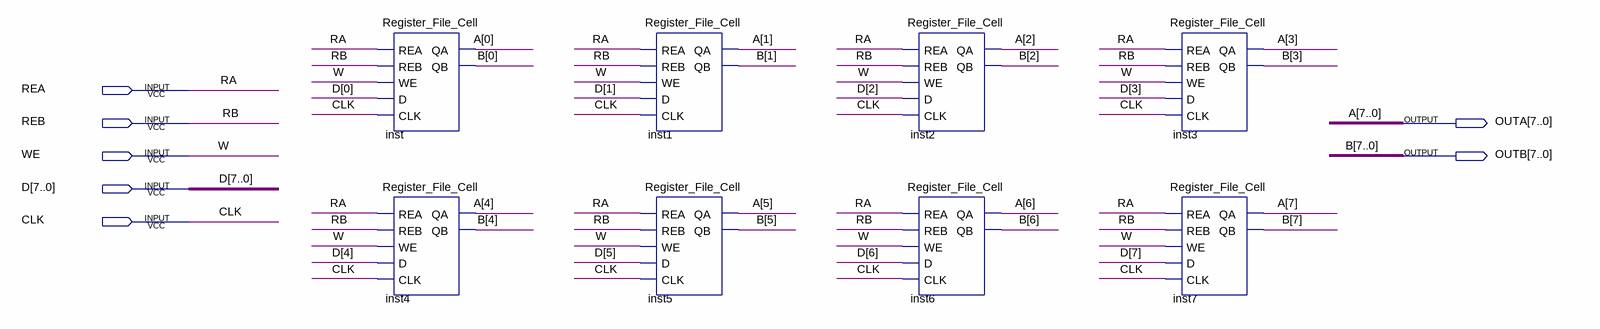
[diagram p0: schematic sheet]
// Quartus schematic Register_File_1X8.bdf as structural Verilog: 8 symbols, 7 pins
module Register_File_1X8 (
  input  REA,
  input  REB,
  input  WE,
  input  [7:0] D,
  input  CLK,
  output [7:0] OUTA,
  output [7:0] OUTB
);

  Register_File_Cell inst (.REA(REA), .REB(REB), .WE(WE), .D(D[0]), .CLK(CLK), .QA(OUTA[0]), .QB(OUTB[0]));
  Register_File_Cell inst4 (.REA(REA), .REB(REB), .WE(WE), .D(D[4]), .CLK(CLK), .QA(OUTA[4]), .QB(OUTB[4]));
  Register_File_Cell inst1 (.REA(REA), .REB(REB), .WE(WE), .D(D[1]), .CLK(CLK), .QA(OUTA[1]), .QB(OUTB[1]));
  Register_File_Cell inst5 (.REA(REA), .REB(REB), .WE(WE), .D(D[5]), .CLK(CLK), .QA(OUTA[5]), .QB(OUTB[5]));
  Register_File_Cell inst2 (.REA(REA), .REB(REB), .WE(WE), .D(D[2]), .CLK(CLK), .QA(OUTA[2]), .QB(OUTB[2]));
  Register_File_Cell inst6 (.REA(REA), .REB(REB), .WE(WE), .D(D[6]), .CLK(CLK), .QA(OUTA[6]), .QB(OUTB[6]));
  Register_File_Cell inst3 (.REA(REA), .REB(REB), .WE(WE), .D(D[3]), .CLK(CLK), .QA(OUTA[3]), .QB(OUTB[3]));
  Register_File_Cell inst7 (.REA(REA), .REB(REB), .WE(WE), .D(D[7]), .CLK(CLK), .QA(OUTA[7]), .QB(OUTB[7]));

  // Other names for the same wires on the sheet: A[7:0] = OUTA; B[7:0] = OUTB; RA = REA; RB = REB; W = WE
endmodule
